# Altium schematic sheet 2_RGB's knees.schdoc
size 604 x 431 mm; Symbol: Sheet-Symbol_A4; Device: Sheet-Symbol_A4; Company: EasyEDA.com; Drawed: Prash; Reviewed: Prash; Version: V0.1; Page Size: A4; @Project Name: URC merc keyboard; @Page Count: 2; @Update Date: 2024-04-11; @Create Date: 2023-04-20; @Schematic Name: Schematic1; Part Number: urc75; @Page No: 2; @Page Name: RGB's knees
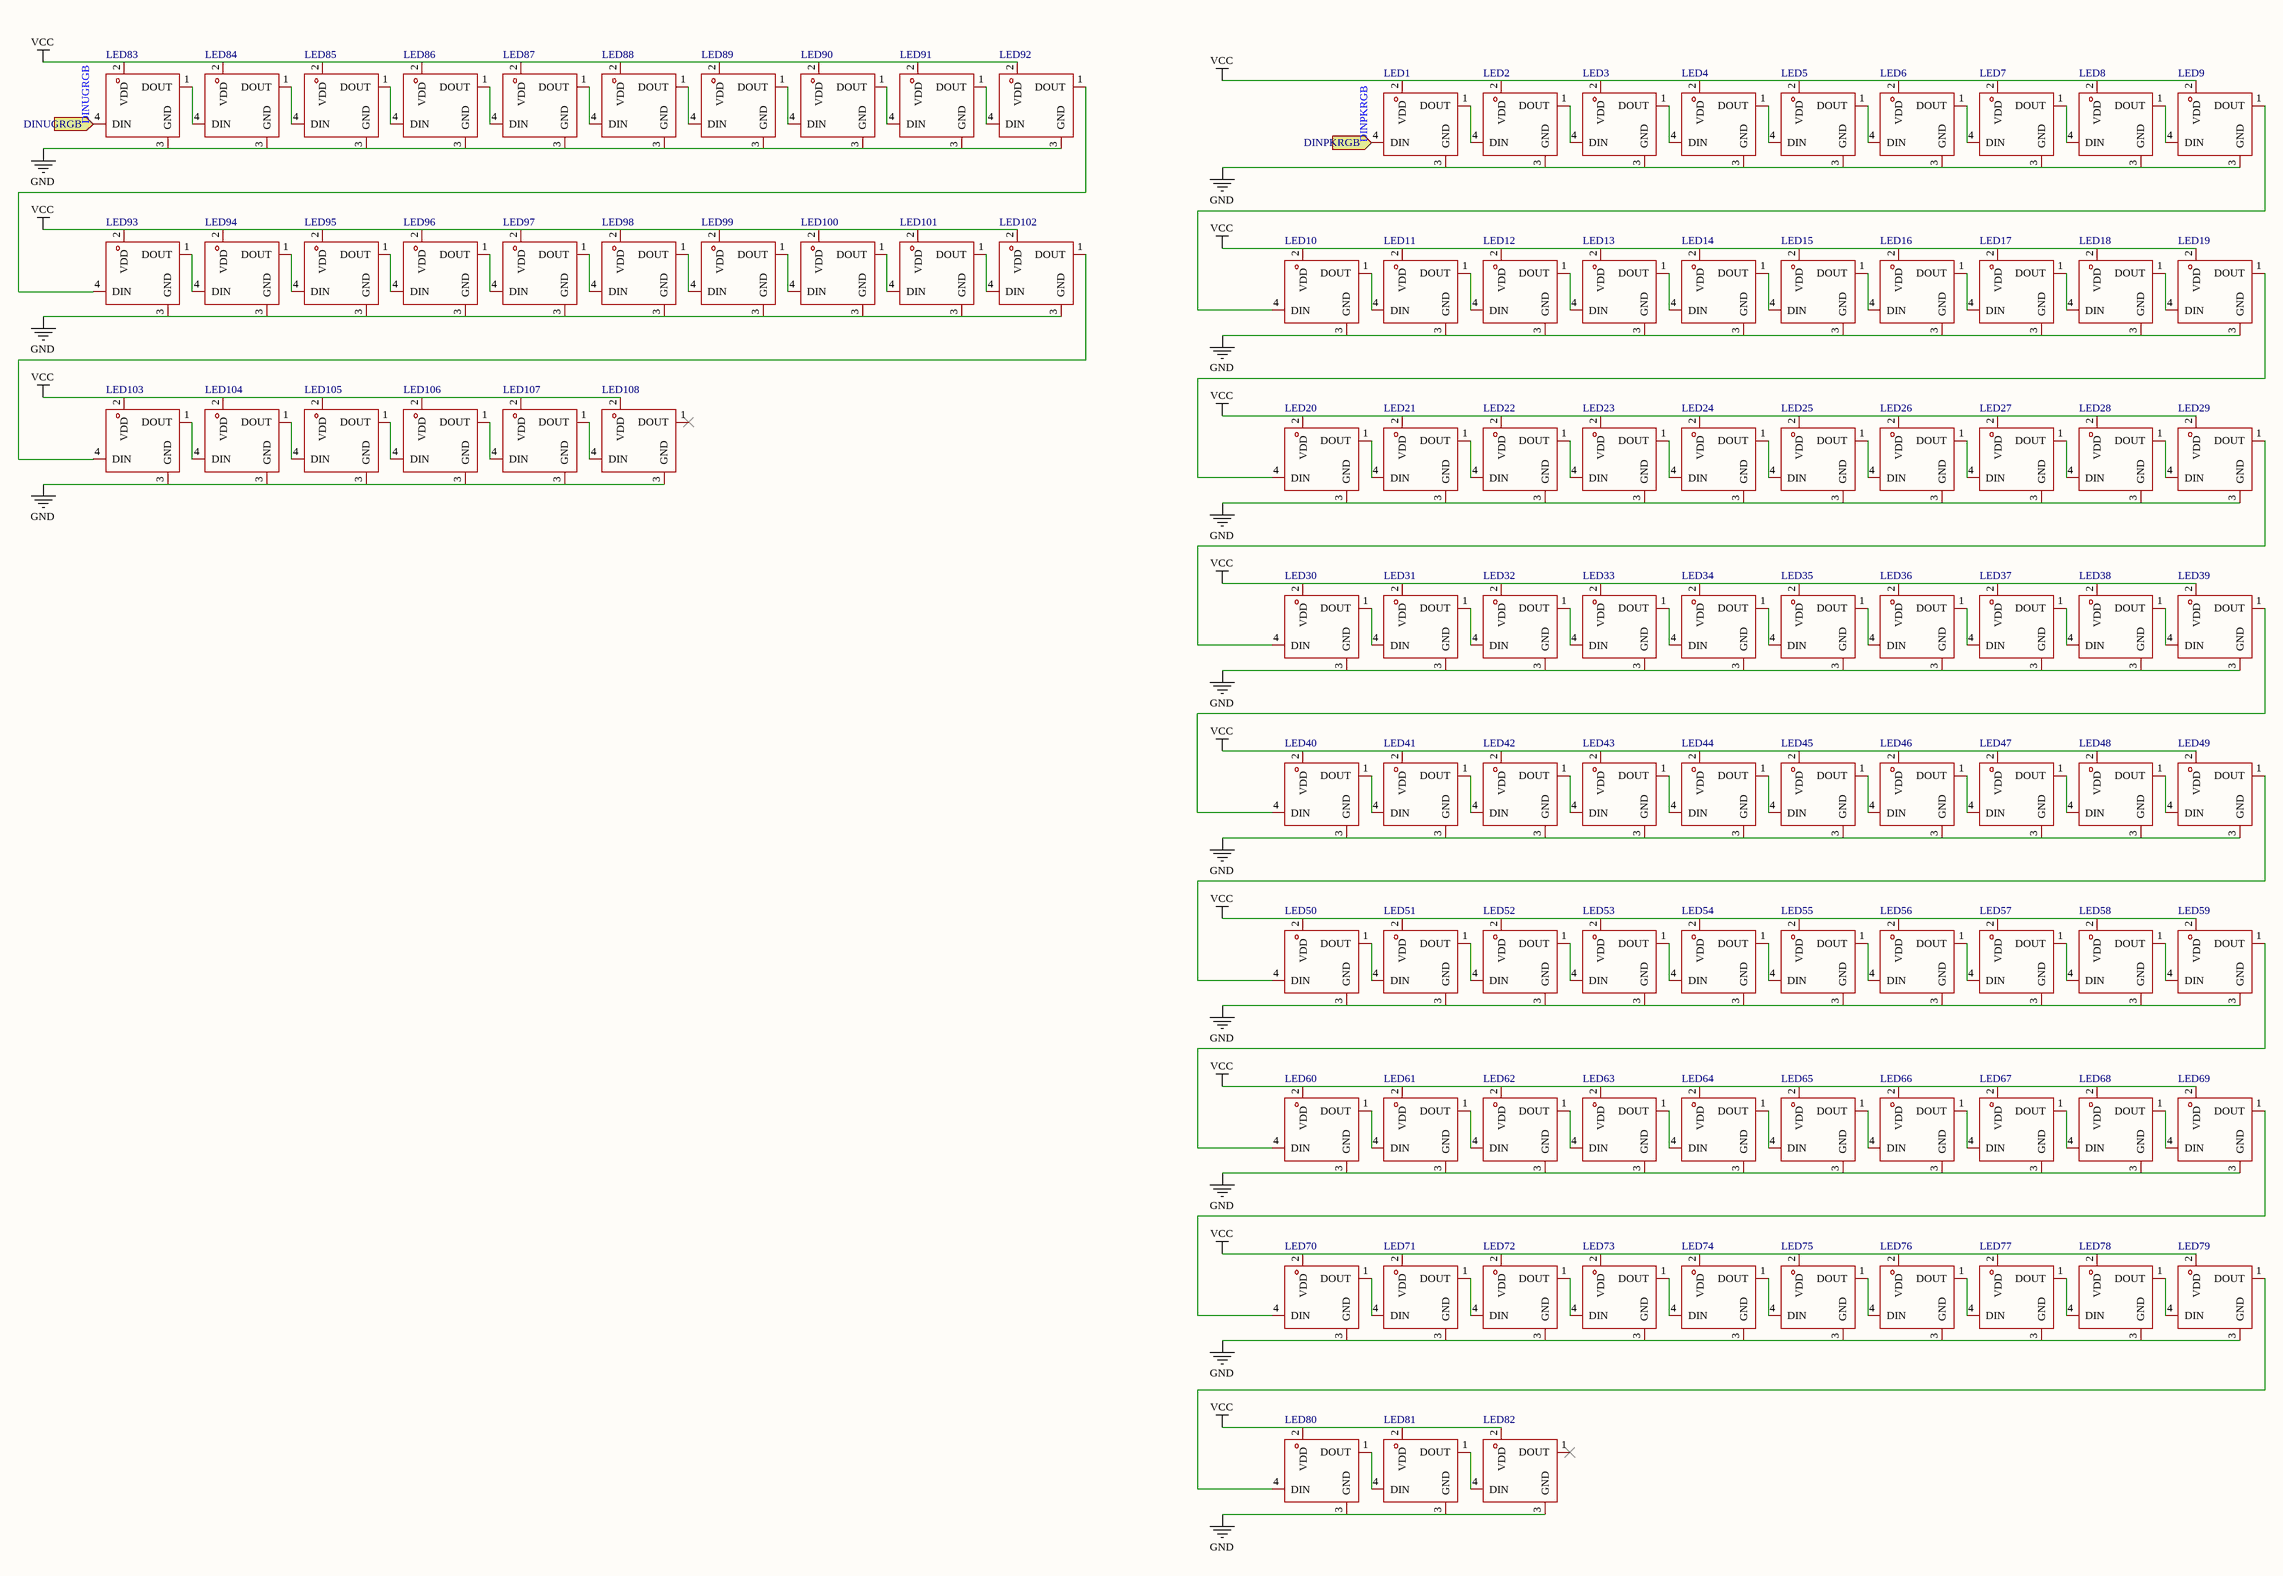
[diagram p0: 2_RGB's knees.schdoc]

## Parts
LED1  XL-1010RGBC-WS2812B  [LED-SMD_4P-L1.0-W1.0-TL_XL-1010RGBC-WS2812B]  (value not drawn)
LED2  XL-1010RGBC-WS2812B  [LED-SMD_4P-L1.0-W1.0-TL_XL-1010RGBC-WS2812B]  (value not drawn)
LED3  XL-1010RGBC-WS2812B  [LED-SMD_4P-L1.0-W1.0-TL_XL-1010RGBC-WS2812B]  (value not drawn)
LED4  XL-1010RGBC-WS2812B  [LED-SMD_4P-L1.0-W1.0-TL_XL-1010RGBC-WS2812B]  (value not drawn)
LED5  XL-1010RGBC-WS2812B  [LED-SMD_4P-L1.0-W1.0-TL_XL-1010RGBC-WS2812B]  (value not drawn)
LED6  XL-1010RGBC-WS2812B  [LED-SMD_4P-L1.0-W1.0-TL_XL-1010RGBC-WS2812B]  (value not drawn)
LED7  XL-1010RGBC-WS2812B  [LED-SMD_4P-L1.0-W1.0-TL_XL-1010RGBC-WS2812B]  (value not drawn)
LED8  XL-1010RGBC-WS2812B  [LED-SMD_4P-L1.0-W1.0-TL_XL-1010RGBC-WS2812B]  (value not drawn)
LED9  XL-1010RGBC-WS2812B  [LED-SMD_4P-L1.0-W1.0-TL_XL-1010RGBC-WS2812B]  (value not drawn)
LED10  XL-1010RGBC-WS2812B  [LED-SMD_4P-L1.0-W1.0-TL_XL-1010RGBC-WS2812B]  (value not drawn)
LED11  XL-1010RGBC-WS2812B  [LED-SMD_4P-L1.0-W1.0-TL_XL-1010RGBC-WS2812B]  (value not drawn)
LED12  XL-1010RGBC-WS2812B  [LED-SMD_4P-L1.0-W1.0-TL_XL-1010RGBC-WS2812B]  (value not drawn)
LED13  XL-1010RGBC-WS2812B  [LED-SMD_4P-L1.0-W1.0-TL_XL-1010RGBC-WS2812B]  (value not drawn)
LED14  XL-1010RGBC-WS2812B  [LED-SMD_4P-L1.0-W1.0-TL_XL-1010RGBC-WS2812B]  (value not drawn)
LED15  XL-1010RGBC-WS2812B  [LED-SMD_4P-L1.0-W1.0-TL_XL-1010RGBC-WS2812B]  (value not drawn)
LED16  XL-1010RGBC-WS2812B  [LED-SMD_4P-L1.0-W1.0-TL_XL-1010RGBC-WS2812B]  (value not drawn)
LED17  XL-1010RGBC-WS2812B  [LED-SMD_4P-L1.0-W1.0-TL_XL-1010RGBC-WS2812B]  (value not drawn)
LED18  XL-1010RGBC-WS2812B  [LED-SMD_4P-L1.0-W1.0-TL_XL-1010RGBC-WS2812B]  (value not drawn)
LED19  XL-1010RGBC-WS2812B  [LED-SMD_4P-L1.0-W1.0-TL_XL-1010RGBC-WS2812B]  (value not drawn)
LED20  XL-1010RGBC-WS2812B  [LED-SMD_4P-L1.0-W1.0-TL_XL-1010RGBC-WS2812B]  (value not drawn)
LED21  XL-1010RGBC-WS2812B  [LED-SMD_4P-L1.0-W1.0-TL_XL-1010RGBC-WS2812B]  (value not drawn)
LED22  XL-1010RGBC-WS2812B  [LED-SMD_4P-L1.0-W1.0-TL_XL-1010RGBC-WS2812B]  (value not drawn)
LED23  XL-1010RGBC-WS2812B  [LED-SMD_4P-L1.0-W1.0-TL_XL-1010RGBC-WS2812B]  (value not drawn)
LED24  XL-1010RGBC-WS2812B  [LED-SMD_4P-L1.0-W1.0-TL_XL-1010RGBC-WS2812B]  (value not drawn)
LED25  XL-1010RGBC-WS2812B  [LED-SMD_4P-L1.0-W1.0-TL_XL-1010RGBC-WS2812B]  (value not drawn)
LED26  XL-1010RGBC-WS2812B  [LED-SMD_4P-L1.0-W1.0-TL_XL-1010RGBC-WS2812B]  (value not drawn)
LED27  XL-1010RGBC-WS2812B  [LED-SMD_4P-L1.0-W1.0-TL_XL-1010RGBC-WS2812B]  (value not drawn)
LED28  XL-1010RGBC-WS2812B  [LED-SMD_4P-L1.0-W1.0-TL_XL-1010RGBC-WS2812B]  (value not drawn)
LED29  XL-1010RGBC-WS2812B  [LED-SMD_4P-L1.0-W1.0-TL_XL-1010RGBC-WS2812B]  (value not drawn)
LED30  XL-1010RGBC-WS2812B  [LED-SMD_4P-L1.0-W1.0-TL_XL-1010RGBC-WS2812B]  (value not drawn)
LED31  XL-1010RGBC-WS2812B  [LED-SMD_4P-L1.0-W1.0-TL_XL-1010RGBC-WS2812B]  (value not drawn)
LED32  XL-1010RGBC-WS2812B  [LED-SMD_4P-L1.0-W1.0-TL_XL-1010RGBC-WS2812B]  (value not drawn)
LED33  XL-1010RGBC-WS2812B  [LED-SMD_4P-L1.0-W1.0-TL_XL-1010RGBC-WS2812B]  (value not drawn)
LED34  XL-1010RGBC-WS2812B  [LED-SMD_4P-L1.0-W1.0-TL_XL-1010RGBC-WS2812B]  (value not drawn)
LED35  XL-1010RGBC-WS2812B  [LED-SMD_4P-L1.0-W1.0-TL_XL-1010RGBC-WS2812B]  (value not drawn)
LED36  XL-1010RGBC-WS2812B  [LED-SMD_4P-L1.0-W1.0-TL_XL-1010RGBC-WS2812B]  (value not drawn)
LED37  XL-1010RGBC-WS2812B  [LED-SMD_4P-L1.0-W1.0-TL_XL-1010RGBC-WS2812B]  (value not drawn)
LED38  XL-1010RGBC-WS2812B  [LED-SMD_4P-L1.0-W1.0-TL_XL-1010RGBC-WS2812B]  (value not drawn)
LED39  XL-1010RGBC-WS2812B  [LED-SMD_4P-L1.0-W1.0-TL_XL-1010RGBC-WS2812B]  (value not drawn)
LED40  XL-1010RGBC-WS2812B  [LED-SMD_4P-L1.0-W1.0-TL_XL-1010RGBC-WS2812B]  (value not drawn)
LED41  XL-1010RGBC-WS2812B  [LED-SMD_4P-L1.0-W1.0-TL_XL-1010RGBC-WS2812B]  (value not drawn)
LED42  XL-1010RGBC-WS2812B  [LED-SMD_4P-L1.0-W1.0-TL_XL-1010RGBC-WS2812B]  (value not drawn)
LED43  XL-1010RGBC-WS2812B  [LED-SMD_4P-L1.0-W1.0-TL_XL-1010RGBC-WS2812B]  (value not drawn)
LED44  XL-1010RGBC-WS2812B  [LED-SMD_4P-L1.0-W1.0-TL_XL-1010RGBC-WS2812B]  (value not drawn)
LED45  XL-1010RGBC-WS2812B  [LED-SMD_4P-L1.0-W1.0-TL_XL-1010RGBC-WS2812B]  (value not drawn)
LED46  XL-1010RGBC-WS2812B  [LED-SMD_4P-L1.0-W1.0-TL_XL-1010RGBC-WS2812B]  (value not drawn)
LED47  XL-1010RGBC-WS2812B  [LED-SMD_4P-L1.0-W1.0-TL_XL-1010RGBC-WS2812B]  (value not drawn)
LED48  XL-1010RGBC-WS2812B  [LED-SMD_4P-L1.0-W1.0-TL_XL-1010RGBC-WS2812B]  (value not drawn)
LED49  XL-1010RGBC-WS2812B  [LED-SMD_4P-L1.0-W1.0-TL_XL-1010RGBC-WS2812B]  (value not drawn)
LED50  XL-1010RGBC-WS2812B  [LED-SMD_4P-L1.0-W1.0-TL_XL-1010RGBC-WS2812B]  (value not drawn)
LED51  XL-1010RGBC-WS2812B  [LED-SMD_4P-L1.0-W1.0-TL_XL-1010RGBC-WS2812B]  (value not drawn)
LED52  XL-1010RGBC-WS2812B  [LED-SMD_4P-L1.0-W1.0-TL_XL-1010RGBC-WS2812B]  (value not drawn)
LED53  XL-1010RGBC-WS2812B  [LED-SMD_4P-L1.0-W1.0-TL_XL-1010RGBC-WS2812B]  (value not drawn)
LED54  XL-1010RGBC-WS2812B  [LED-SMD_4P-L1.0-W1.0-TL_XL-1010RGBC-WS2812B]  (value not drawn)
LED55  XL-1010RGBC-WS2812B  [LED-SMD_4P-L1.0-W1.0-TL_XL-1010RGBC-WS2812B]  (value not drawn)
LED56  XL-1010RGBC-WS2812B  [LED-SMD_4P-L1.0-W1.0-TL_XL-1010RGBC-WS2812B]  (value not drawn)
LED57  XL-1010RGBC-WS2812B  [LED-SMD_4P-L1.0-W1.0-TL_XL-1010RGBC-WS2812B]  (value not drawn)
LED58  XL-1010RGBC-WS2812B  [LED-SMD_4P-L1.0-W1.0-TL_XL-1010RGBC-WS2812B]  (value not drawn)
LED59  XL-1010RGBC-WS2812B  [LED-SMD_4P-L1.0-W1.0-TL_XL-1010RGBC-WS2812B]  (value not drawn)
LED60  XL-1010RGBC-WS2812B  [LED-SMD_4P-L1.0-W1.0-TL_XL-1010RGBC-WS2812B]  (value not drawn)
LED61  XL-1010RGBC-WS2812B  [LED-SMD_4P-L1.0-W1.0-TL_XL-1010RGBC-WS2812B]  (value not drawn)
LED62  XL-1010RGBC-WS2812B  [LED-SMD_4P-L1.0-W1.0-TL_XL-1010RGBC-WS2812B]  (value not drawn)
LED63  XL-1010RGBC-WS2812B  [LED-SMD_4P-L1.0-W1.0-TL_XL-1010RGBC-WS2812B]  (value not drawn)
LED64  XL-1010RGBC-WS2812B  [LED-SMD_4P-L1.0-W1.0-TL_XL-1010RGBC-WS2812B]  (value not drawn)
LED65  XL-1010RGBC-WS2812B  [LED-SMD_4P-L1.0-W1.0-TL_XL-1010RGBC-WS2812B]  (value not drawn)
LED66  XL-1010RGBC-WS2812B  [LED-SMD_4P-L1.0-W1.0-TL_XL-1010RGBC-WS2812B]  (value not drawn)
LED67  XL-1010RGBC-WS2812B  [LED-SMD_4P-L1.0-W1.0-TL_XL-1010RGBC-WS2812B]  (value not drawn)
LED68  XL-1010RGBC-WS2812B  [LED-SMD_4P-L1.0-W1.0-TL_XL-1010RGBC-WS2812B]  (value not drawn)
LED69  XL-1010RGBC-WS2812B  [LED-SMD_4P-L1.0-W1.0-TL_XL-1010RGBC-WS2812B]  (value not drawn)
LED70  XL-1010RGBC-WS2812B  [LED-SMD_4P-L1.0-W1.0-TL_XL-1010RGBC-WS2812B]  (value not drawn)
LED71  XL-1010RGBC-WS2812B  [LED-SMD_4P-L1.0-W1.0-TL_XL-1010RGBC-WS2812B]  (value not drawn)
LED72  XL-1010RGBC-WS2812B  [LED-SMD_4P-L1.0-W1.0-TL_XL-1010RGBC-WS2812B]  (value not drawn)
LED73  XL-1010RGBC-WS2812B  [LED-SMD_4P-L1.0-W1.0-TL_XL-1010RGBC-WS2812B]  (value not drawn)
LED74  XL-1010RGBC-WS2812B  [LED-SMD_4P-L1.0-W1.0-TL_XL-1010RGBC-WS2812B]  (value not drawn)
LED75  XL-1010RGBC-WS2812B  [LED-SMD_4P-L1.0-W1.0-TL_XL-1010RGBC-WS2812B]  (value not drawn)
LED76  XL-1010RGBC-WS2812B  [LED-SMD_4P-L1.0-W1.0-TL_XL-1010RGBC-WS2812B]  (value not drawn)
LED77  XL-1010RGBC-WS2812B  [LED-SMD_4P-L1.0-W1.0-TL_XL-1010RGBC-WS2812B]  (value not drawn)
LED78  XL-1010RGBC-WS2812B  [LED-SMD_4P-L1.0-W1.0-TL_XL-1010RGBC-WS2812B]  (value not drawn)
LED79  XL-1010RGBC-WS2812B  [LED-SMD_4P-L1.0-W1.0-TL_XL-1010RGBC-WS2812B]  (value not drawn)
LED80  XL-1010RGBC-WS2812B  [LED-SMD_4P-L1.0-W1.0-TL_XL-1010RGBC-WS2812B]  (value not drawn)
LED81  XL-1010RGBC-WS2812B  [LED-SMD_4P-L1.0-W1.0-TL_XL-1010RGBC-WS2812B]  (value not drawn)
LED82  XL-1010RGBC-WS2812B  [LED-SMD_4P-L1.0-W1.0-TL_XL-1010RGBC-WS2812B]  (value not drawn)
LED83  XL-1010RGBC-WS2812B  [LED-SMD_4P-L1.0-W1.0-TL_XL-1010RGBC-WS2812B]  (value not drawn)
LED84  XL-1010RGBC-WS2812B  [LED-SMD_4P-L1.0-W1.0-TL_XL-1010RGBC-WS2812B]  (value not drawn)
LED85  XL-1010RGBC-WS2812B  [LED-SMD_4P-L1.0-W1.0-TL_XL-1010RGBC-WS2812B]  (value not drawn)
LED86  XL-1010RGBC-WS2812B  [LED-SMD_4P-L1.0-W1.0-TL_XL-1010RGBC-WS2812B]  (value not drawn)
LED87  XL-1010RGBC-WS2812B  [LED-SMD_4P-L1.0-W1.0-TL_XL-1010RGBC-WS2812B]  (value not drawn)
LED88  XL-1010RGBC-WS2812B  [LED-SMD_4P-L1.0-W1.0-TL_XL-1010RGBC-WS2812B]  (value not drawn)
LED89  XL-1010RGBC-WS2812B  [LED-SMD_4P-L1.0-W1.0-TL_XL-1010RGBC-WS2812B]  (value not drawn)
LED90  XL-1010RGBC-WS2812B  [LED-SMD_4P-L1.0-W1.0-TL_XL-1010RGBC-WS2812B]  (value not drawn)
LED91  XL-1010RGBC-WS2812B  [LED-SMD_4P-L1.0-W1.0-TL_XL-1010RGBC-WS2812B]  (value not drawn)
LED92  XL-1010RGBC-WS2812B  [LED-SMD_4P-L1.0-W1.0-TL_XL-1010RGBC-WS2812B]  (value not drawn)
LED93  XL-1010RGBC-WS2812B  [LED-SMD_4P-L1.0-W1.0-TL_XL-1010RGBC-WS2812B]  (value not drawn)
LED94  XL-1010RGBC-WS2812B  [LED-SMD_4P-L1.0-W1.0-TL_XL-1010RGBC-WS2812B]  (value not drawn)
LED95  XL-1010RGBC-WS2812B  [LED-SMD_4P-L1.0-W1.0-TL_XL-1010RGBC-WS2812B]  (value not drawn)
LED96  XL-1010RGBC-WS2812B  [LED-SMD_4P-L1.0-W1.0-TL_XL-1010RGBC-WS2812B]  (value not drawn)
LED97  XL-1010RGBC-WS2812B  [LED-SMD_4P-L1.0-W1.0-TL_XL-1010RGBC-WS2812B]  (value not drawn)
LED98  XL-1010RGBC-WS2812B  [LED-SMD_4P-L1.0-W1.0-TL_XL-1010RGBC-WS2812B]  (value not drawn)
LED99  XL-1010RGBC-WS2812B  [LED-SMD_4P-L1.0-W1.0-TL_XL-1010RGBC-WS2812B]  (value not drawn)
LED100  XL-1010RGBC-WS2812B  [LED-SMD_4P-L1.0-W1.0-TL_XL-1010RGBC-WS2812B]  (value not drawn)
LED101  XL-1010RGBC-WS2812B  [LED-SMD_4P-L1.0-W1.0-TL_XL-1010RGBC-WS2812B]  (value not drawn)
LED102  XL-1010RGBC-WS2812B  [LED-SMD_4P-L1.0-W1.0-TL_XL-1010RGBC-WS2812B]  (value not drawn)
LED103  XL-1010RGBC-WS2812B  [LED-SMD_4P-L1.0-W1.0-TL_XL-1010RGBC-WS2812B]  (value not drawn)
LED104  XL-1010RGBC-WS2812B  [LED-SMD_4P-L1.0-W1.0-TL_XL-1010RGBC-WS2812B]  (value not drawn)
LED105  XL-1010RGBC-WS2812B  [LED-SMD_4P-L1.0-W1.0-TL_XL-1010RGBC-WS2812B]  (value not drawn)
LED106  XL-1010RGBC-WS2812B  [LED-SMD_4P-L1.0-W1.0-TL_XL-1010RGBC-WS2812B]  (value not drawn)
LED107  XL-1010RGBC-WS2812B  [LED-SMD_4P-L1.0-W1.0-TL_XL-1010RGBC-WS2812B]  (value not drawn)
LED108  XL-1010RGBC-WS2812B  [LED-SMD_4P-L1.0-W1.0-TL_XL-1010RGBC-WS2812B]  (value not drawn)

## Ports
DINPKRGB (in), DINUGRGB (in)

## Nets
GND: LED1.3(GND) LED2.3(GND) LED3.3(GND) LED4.3(GND) LED5.3(GND) LED6.3(GND) LED7.3(GND) LED8.3(GND) LED9.3(GND) LED10.3(GND) LED11.3(GND) LED12.3(GND) LED13.3(GND) LED14.3(GND) LED15.3(GND) LED16.3(GND) LED17.3(GND) LED18.3(GND) LED19.3(GND) LED20.3(GND) LED21.3(GND) LED22.3(GND) LED23.3(GND) LED24.3(GND) LED25.3(GND) LED26.3(GND) LED27.3(GND) LED28.3(GND) LED29.3(GND) LED30.3(GND) LED31.3(GND) LED32.3(GND) LED33.3(GND) LED34.3(GND) LED35.3(GND) LED36.3(GND) LED37.3(GND) LED38.3(GND) LED39.3(GND) LED40.3(GND) LED41.3(GND) LED42.3(GND) LED43.3(GND) LED44.3(GND) LED45.3(GND) LED46.3(GND) LED47.3(GND) LED48.3(GND) LED49.3(GND) LED50.3(GND) LED51.3(GND) LED52.3(GND) LED53.3(GND) LED54.3(GND) LED55.3(GND) LED56.3(GND) LED57.3(GND) LED58.3(GND) LED59.3(GND) LED60.3(GND) LED61.3(GND) LED62.3(GND) LED63.3(GND) LED64.3(GND) LED65.3(GND) LED66.3(GND) LED67.3(GND) LED68.3(GND) LED69.3(GND) LED70.3(GND) LED71.3(GND) LED72.3(GND) LED73.3(GND) LED74.3(GND) LED75.3(GND) LED76.3(GND) LED77.3(GND) LED78.3(GND) LED79.3(GND) LED80.3(GND) LED81.3(GND) LED82.3(GND) LED83.3(GND) LED84.3(GND) LED85.3(GND) LED86.3(GND) LED87.3(GND) LED88.3(GND) LED89.3(GND) LED90.3(GND) LED91.3(GND) LED92.3(GND) LED93.3(GND) LED94.3(GND) LED95.3(GND) LED96.3(GND) LED97.3(GND) LED98.3(GND) LED99.3(GND) LED100.3(GND) LED101.3(GND) LED102.3(GND) LED103.3(GND) LED104.3(GND) LED105.3(GND) LED106.3(GND) LED107.3(GND) LED108.3(GND)
VCC: LED1.2(VDD) LED2.2(VDD) LED3.2(VDD) LED4.2(VDD) LED5.2(VDD) LED6.2(VDD) LED7.2(VDD) LED8.2(VDD) LED9.2(VDD) LED10.2(VDD) LED11.2(VDD) LED12.2(VDD) LED13.2(VDD) LED14.2(VDD) LED15.2(VDD) LED16.2(VDD) LED17.2(VDD) LED18.2(VDD) LED19.2(VDD) LED20.2(VDD) LED21.2(VDD) LED22.2(VDD) LED23.2(VDD) LED24.2(VDD) LED25.2(VDD) LED26.2(VDD) LED27.2(VDD) LED28.2(VDD) LED29.2(VDD) LED30.2(VDD) LED31.2(VDD) LED32.2(VDD) LED33.2(VDD) LED34.2(VDD) LED35.2(VDD) LED36.2(VDD) LED37.2(VDD) LED38.2(VDD) LED39.2(VDD) LED40.2(VDD) LED41.2(VDD) LED42.2(VDD) LED43.2(VDD) LED44.2(VDD) LED45.2(VDD) LED46.2(VDD) LED47.2(VDD) LED48.2(VDD) LED49.2(VDD) LED50.2(VDD) LED51.2(VDD) LED52.2(VDD) LED53.2(VDD) LED54.2(VDD) LED55.2(VDD) LED56.2(VDD) LED57.2(VDD) LED58.2(VDD) LED59.2(VDD) LED60.2(VDD) LED61.2(VDD) LED62.2(VDD) LED63.2(VDD) LED64.2(VDD) LED65.2(VDD) LED66.2(VDD) LED67.2(VDD) LED68.2(VDD) LED69.2(VDD) LED70.2(VDD) LED71.2(VDD) LED72.2(VDD) LED73.2(VDD) LED74.2(VDD) LED75.2(VDD) LED76.2(VDD) LED77.2(VDD) LED78.2(VDD) LED79.2(VDD) LED80.2(VDD) LED81.2(VDD) LED82.2(VDD) LED83.2(VDD) LED84.2(VDD) LED85.2(VDD) LED86.2(VDD) LED87.2(VDD) LED88.2(VDD) LED89.2(VDD) LED90.2(VDD) LED91.2(VDD) LED92.2(VDD) LED93.2(VDD) LED94.2(VDD) LED95.2(VDD) LED96.2(VDD) LED97.2(VDD) LED98.2(VDD) LED99.2(VDD) LED100.2(VDD) LED101.2(VDD) LED102.2(VDD) LED103.2(VDD) LED104.2(VDD) LED105.2(VDD) LED106.2(VDD) LED107.2(VDD) LED108.2(VDD)
DINPKRGB: LED1.4(DIN) ; port DINPKRGB
DINUGRGB: LED83.4(DIN) ; port DINUGRGB
NetLED1_1: LED1.1(DOUT) LED2.4(DIN)
NetLED2_1: LED2.1(DOUT) LED3.4(DIN)
NetLED3_1: LED3.1(DOUT) LED4.4(DIN)
NetLED4_1: LED4.1(DOUT) LED5.4(DIN)
NetLED5_1: LED5.1(DOUT) LED6.4(DIN)
NetLED6_1: LED6.1(DOUT) LED7.4(DIN)
NetLED7_1: LED7.1(DOUT) LED8.4(DIN)
NetLED8_1: LED8.1(DOUT) LED9.4(DIN)
NetLED9_1: LED9.1(DOUT) LED10.4(DIN)
NetLED10_1: LED10.1(DOUT) LED11.4(DIN)
NetLED11_1: LED11.1(DOUT) LED12.4(DIN)
NetLED12_1: LED12.1(DOUT) LED13.4(DIN)
NetLED13_1: LED13.1(DOUT) LED14.4(DIN)
NetLED14_1: LED14.1(DOUT) LED15.4(DIN)
NetLED15_1: LED15.1(DOUT) LED16.4(DIN)
NetLED16_1: LED16.1(DOUT) LED17.4(DIN)
NetLED17_1: LED17.1(DOUT) LED18.4(DIN)
NetLED18_1: LED18.1(DOUT) LED19.4(DIN)
NetLED19_1: LED19.1(DOUT) LED20.4(DIN)
NetLED20_1: LED20.1(DOUT) LED21.4(DIN)
NetLED21_1: LED21.1(DOUT) LED22.4(DIN)
NetLED22_1: LED22.1(DOUT) LED23.4(DIN)
NetLED23_1: LED23.1(DOUT) LED24.4(DIN)
NetLED24_1: LED24.1(DOUT) LED25.4(DIN)
NetLED25_1: LED25.1(DOUT) LED26.4(DIN)
NetLED26_1: LED26.1(DOUT) LED27.4(DIN)
NetLED27_1: LED27.1(DOUT) LED28.4(DIN)
NetLED28_1: LED28.1(DOUT) LED29.4(DIN)
NetLED29_1: LED29.1(DOUT) LED30.4(DIN)
NetLED30_1: LED30.1(DOUT) LED31.4(DIN)
NetLED31_1: LED31.1(DOUT) LED32.4(DIN)
NetLED32_1: LED32.1(DOUT) LED33.4(DIN)
NetLED33_1: LED33.1(DOUT) LED34.4(DIN)
NetLED34_1: LED34.1(DOUT) LED35.4(DIN)
NetLED35_1: LED35.1(DOUT) LED36.4(DIN)
NetLED36_1: LED36.1(DOUT) LED37.4(DIN)
NetLED37_1: LED37.1(DOUT) LED38.4(DIN)
NetLED38_1: LED38.1(DOUT) LED39.4(DIN)
NetLED39_1: LED39.1(DOUT) LED40.4(DIN)
NetLED40_1: LED40.1(DOUT) LED41.4(DIN)
NetLED41_1: LED41.1(DOUT) LED42.4(DIN)
NetLED42_1: LED42.1(DOUT) LED43.4(DIN)
NetLED43_1: LED43.1(DOUT) LED44.4(DIN)
NetLED44_1: LED44.1(DOUT) LED45.4(DIN)
NetLED45_1: LED45.1(DOUT) LED46.4(DIN)
NetLED46_1: LED46.1(DOUT) LED47.4(DIN)
NetLED47_1: LED47.1(DOUT) LED48.4(DIN)
NetLED48_1: LED48.1(DOUT) LED49.4(DIN)
NetLED49_1: LED49.1(DOUT) LED50.4(DIN)
NetLED50_1: LED50.1(DOUT) LED51.4(DIN)
NetLED51_1: LED51.1(DOUT) LED52.4(DIN)
NetLED52_1: LED52.1(DOUT) LED53.4(DIN)
NetLED53_1: LED53.1(DOUT) LED54.4(DIN)
NetLED54_1: LED54.1(DOUT) LED55.4(DIN)
NetLED55_1: LED55.1(DOUT) LED56.4(DIN)
NetLED56_1: LED56.1(DOUT) LED57.4(DIN)
NetLED57_1: LED57.1(DOUT) LED58.4(DIN)
NetLED58_1: LED58.1(DOUT) LED59.4(DIN)
NetLED59_1: LED59.1(DOUT) LED60.4(DIN)
NetLED60_1: LED60.1(DOUT) LED61.4(DIN)
NetLED61_1: LED61.1(DOUT) LED62.4(DIN)
NetLED62_1: LED62.1(DOUT) LED63.4(DIN)
NetLED63_1: LED63.1(DOUT) LED64.4(DIN)
NetLED64_1: LED64.1(DOUT) LED65.4(DIN)
NetLED65_1: LED65.1(DOUT) LED66.4(DIN)
NetLED66_1: LED66.1(DOUT) LED67.4(DIN)
NetLED67_1: LED67.1(DOUT) LED68.4(DIN)
NetLED68_1: LED68.1(DOUT) LED69.4(DIN)
NetLED69_1: LED69.1(DOUT) LED70.4(DIN)
NetLED70_1: LED70.1(DOUT) LED71.4(DIN)
NetLED71_1: LED71.1(DOUT) LED72.4(DIN)
NetLED72_1: LED72.1(DOUT) LED73.4(DIN)
NetLED73_1: LED73.1(DOUT) LED74.4(DIN)
NetLED74_1: LED74.1(DOUT) LED75.4(DIN)
NetLED75_1: LED75.1(DOUT) LED76.4(DIN)
NetLED76_1: LED76.1(DOUT) LED77.4(DIN)
NetLED77_1: LED77.1(DOUT) LED78.4(DIN)
NetLED78_1: LED78.1(DOUT) LED79.4(DIN)
NetLED79_1: LED79.1(DOUT) LED80.4(DIN)
NetLED80_1: LED80.1(DOUT) LED81.4(DIN)
NetLED81_1: LED81.1(DOUT) LED82.4(DIN)
NetLED83_1: LED83.1(DOUT) LED84.4(DIN)
NetLED84_1: LED84.1(DOUT) LED85.4(DIN)
NetLED85_1: LED85.1(DOUT) LED86.4(DIN)
NetLED86_1: LED86.1(DOUT) LED87.4(DIN)
NetLED87_1: LED87.1(DOUT) LED88.4(DIN)
NetLED88_1: LED88.1(DOUT) LED89.4(DIN)
NetLED89_1: LED89.1(DOUT) LED90.4(DIN)
NetLED90_1: LED90.1(DOUT) LED91.4(DIN)
NetLED91_1: LED91.1(DOUT) LED92.4(DIN)
NetLED92_1: LED92.1(DOUT) LED93.4(DIN)
NetLED93_1: LED93.1(DOUT) LED94.4(DIN)
NetLED94_1: LED94.1(DOUT) LED95.4(DIN)
NetLED95_1: LED95.1(DOUT) LED96.4(DIN)
NetLED96_1: LED96.1(DOUT) LED97.4(DIN)
NetLED97_1: LED97.1(DOUT) LED98.4(DIN)
NetLED98_1: LED98.1(DOUT) LED99.4(DIN)
NetLED99_1: LED99.1(DOUT) LED100.4(DIN)
NetLED100_1: LED100.1(DOUT) LED101.4(DIN)
NetLED101_1: LED101.1(DOUT) LED102.4(DIN)
NetLED102_1: LED102.1(DOUT) LED103.4(DIN)
NetLED103_1: LED103.1(DOUT) LED104.4(DIN)
NetLED104_1: LED104.1(DOUT) LED105.4(DIN)
NetLED105_1: LED105.1(DOUT) LED106.4(DIN)
NetLED106_1: LED106.1(DOUT) LED107.4(DIN)
NetLED107_1: LED107.1(DOUT) LED108.4(DIN)

Not connected (* = marked no-connect by the designer): LED82 1(DOUT)*; LED108 1(DOUT)*

## Notes on the sheet
- 1
- 2
- 3
- 4
- 5
- 6
- A
- B
- C
- D
- Schematic
- Schematic1
- Create Date
- Update Date
- 2024-04-11
- 2023-04-20
- Reviewed
- Drawed
- Page
- Prash
- RGB's knees
- Part Number
- URC merc keyboard
- urc75
- VER
- SIZE
- PAGE
- OF
- V0.1
- A4

## Library data of the parts
LED1-LED108 = XL-1010RGBC-WS2812B: Manufacturer: XINGLIGHT(成兴光); Add into BOM: yes; Emitted Color: RGB; Lens Color: 无色透明; Dominant Wavelength: 465nm~475nm；520nm~530nm；620nm~625nm; Forward Current: 20mA; Forward Voltage (VF): 3.5V~5.5V; Luminous Intensity: 300mcd；800mcd；200mcd; Viewing Angle: 120°; Mounting Sytle: 正贴; Symbol: XL-1010RGBC-WS2812B; Device: XL-1010RGBC-WS2812B; LCSC Part Name: 0404幻彩 0404幻彩; Supplier Part: C5349953; Manufacturer Part: XL-1010RGBC-WS2812B; Supplier Footprint: 1010; JLCPCB Part Class: Extended Part; Datasheet: https://atta.szlcsc.com/upload/public/pdf/source/20230111/7F92487BABF607E2EE42D1D66EFE1A21.pdf; Supplier: LCSC; Convert to PCB: yes; Peak Wavelength: -; Power Dissipation: -; Operating Temperature: -40℃~+150℃